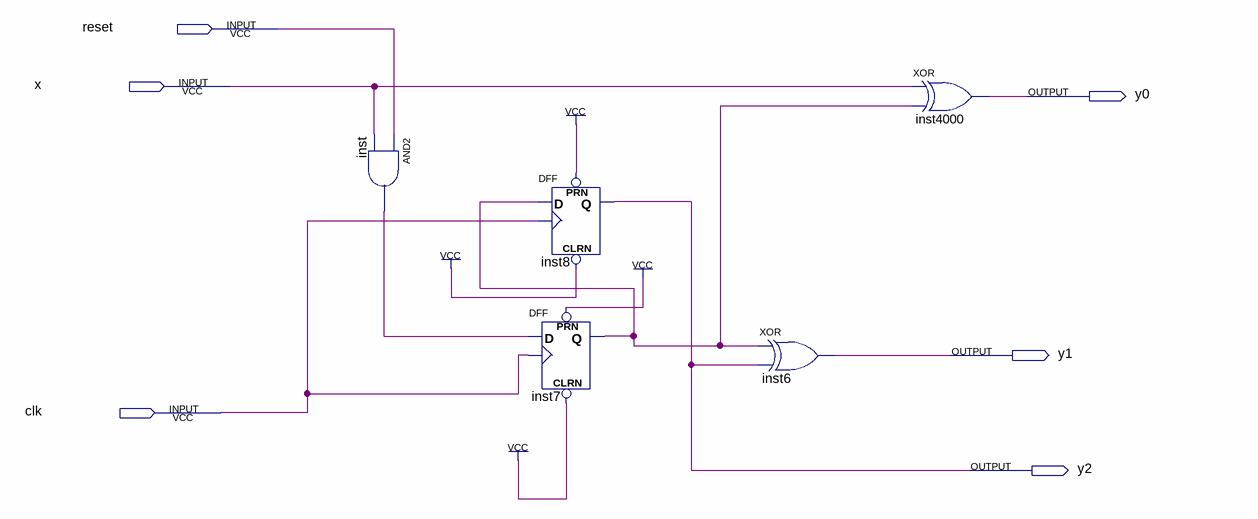
[diagram p0: schematic sheet]
// Quartus schematic Bin2Gray.bdf as structural Verilog: 5 symbols, 6 pins
module Bin2Gray (
  input  reset,
  input  x,
  input  clk,
  output y0,
  output y1,
  output y2
);

  wire inst7_q, inst_out;

  and inst (inst_out, reset, x);
  DFF inst8 (.CLRN(1'b1), .CLK(clk), .D(inst7_q), .PRN(1'b1), .Q(y2));
  DFF inst7 (.CLRN(1'b1), .CLK(clk), .D(inst_out), .PRN(1'b1), .Q(inst7_q));
  xor inst6 (y1, inst7_q, y2);
  xor inst4000 (y0, x, inst7_q);
endmodule
